# Altium schematic sheet etna-main-ui.SchDoc
size A4; DocumentNumber: 1; SheetNumber: 4; SheetTotal: 5; PageSetup: Record=PageOptions|CenterHorizontal=True|CenterVertical=True|PrintScale=0.73|XCorrection=1.00|YCorrection=1.00|PrintKind=1|BorderSize=5000000|LeftOffset=0|BottomOffset=0|Orientation=2|PaperLength=1000|PaperWidth=1000|Scale=100|PaperSource=15|PrintQuality=1200|MediaType=1|DitherType=10|PaperKind=A4|PrintScaleMode=1
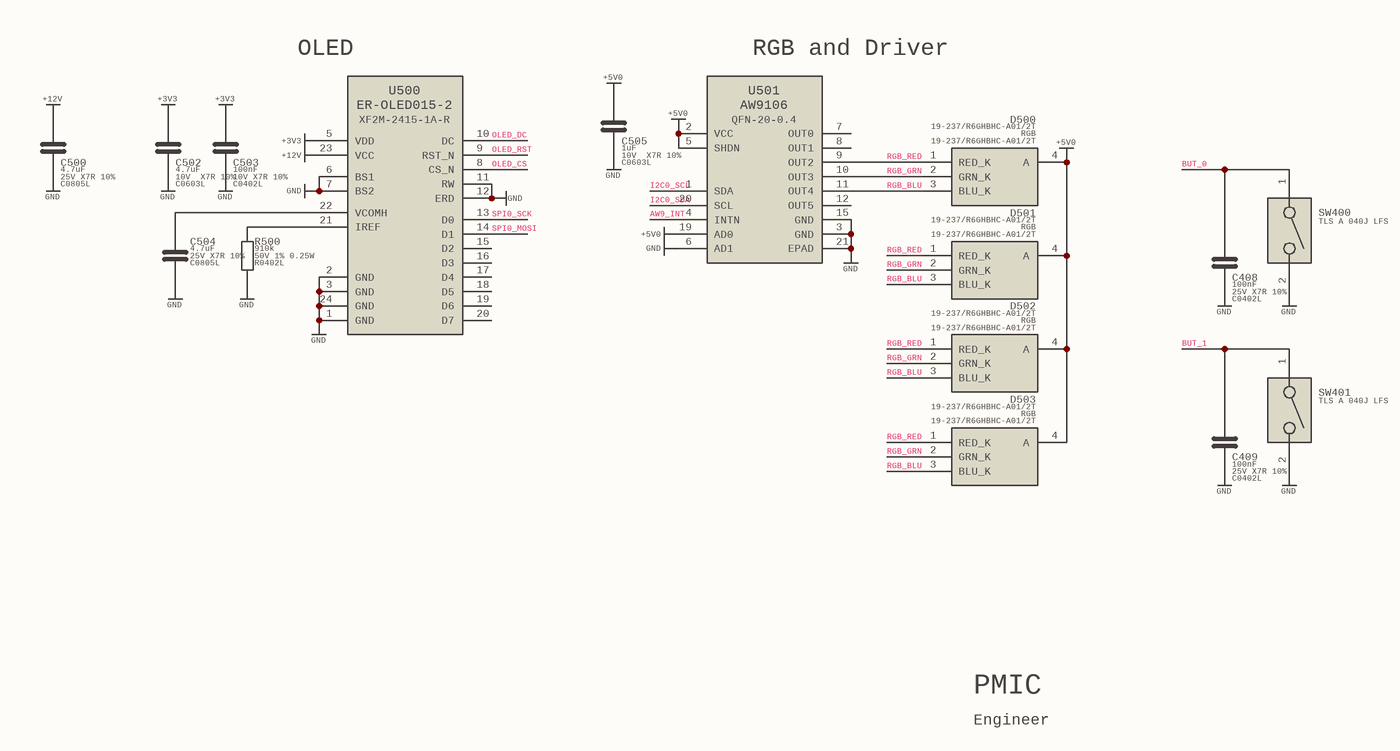
[diagram p0: etna-main-ui.SchDoc]

## Parts
C408  value 100nF  Specification: 25V X7R 10%  [C0402L]
C409  value 100nF  Specification: 25V X7R 10%  [C0402L]
C500  value 4.7uF  Specification: 25V X7R 10%  [C0805L]
C502  value 4.7uF  Specification: 10V  X7R 10%  [C0603L]
C503  value 100nF  Specification: 10V X7R 10%  [C0402L]
C504  value 4.7uF  Specification: 25V X7R 10%  [C0805L]
C505  value 1uF  Specification: 10V  X7R 10%  [C0603L]
D500  Specification: RGB  [19-237/R6GHBHC-A01/2T]  (hidden comment: 19-237/R6GHBHC-A01/2T)
D501  Specification: RGB  [19-237/R6GHBHC-A01/2T]  (hidden comment: 19-237/R6GHBHC-A01/2T)
D502  Specification: RGB  [19-237/R6GHBHC-A01/2T]  (hidden comment: 19-237/R6GHBHC-A01/2T)
D503  Specification: RGB  [19-237/R6GHBHC-A01/2T]  (hidden comment: 19-237/R6GHBHC-A01/2T)
R500  value 910k  Specification: 50V 1% 0.25W  [R0402L]
SW400  TLS A 040J LFS  [TLS A 040J LFS]
SW401  TLS A 040J LFS  [TLS A 040J LFS]
U500  ER-OLED015-2  [XF2M-2415-1A-R]
U501  value AW9106  [QFN-20-0.4]  (hidden comment: AW9109)

## Nets
+3V3: C502.1 C503.1 U500.5(VDD)
+5V0: C505.1 D500.4(A) D501.4(A) D502.4(A) D503.4(A) U501.2(VCC) U501.5(SHDN) U501.19(AD0)
+12V: C500.1 U500.23(VCC)
GND: C408.2 C409.2 C500.2 C502.2 C503.2 C504.2 C505.2 R500.2 SW400.2 SW401.2 U500.1(GND) U500.2(GND) U500.3(GND) U500.6(BS1) U500.7(BS2) U500.11(RW) U500.12(ERD) U500.24(GND) U501.3(GND) U501.6(AD1) U501.15(GND) U501.21(EPAD)
AW9_INT: U501.4(INTN)
BUT_0: C408.1 SW400.1
BUT_1: C409.1 SW401.1
I2C0_SCL: U501.1(SDA)
I2C0_SDA: U501.20(SCL)
OLED_CS: U500.8(CS_N)
OLED_DC: U500.10(DC)
OLED_RST: U500.9(RST_N)
RGB_BLU: D500.3(BLU_K) D501.3(BLU_K) D502.3(BLU_K) D503.3(BLU_K) U501.11(OUT4)
RGB_GRN: D500.2(GRN_K) D501.2(GRN_K) D502.2(GRN_K) D503.2(GRN_K) U501.10(OUT3)
RGB_RED: D500.1(RED_K) D501.1(RED_K) D502.1(RED_K) D503.1(RED_K) U501.9(OUT2)
SPI0_MOSI: U500.14(D1)
SPI0_SCK: U500.13(D0)
NetC504_1: C504.1 U500.22(VCOMH)
NetR500_1: R500.1 U500.21(IREF)

Not connected (* = marked no-connect by the designer): U500 15(D2) 16(D3) 17(D4) 18(D5) 19(D6) 20(D7) 44(N.C.); U501 7(OUT0) 8(OUT1) 12(OUT5) 44(N.C.)

## Notes on the sheet
- OLED
- RGB and Driver
- PMIC
- Engineer

## Library data of the parts
C408 C409 C500 C502-C505 = CAPACITOR_NONPOL
R500 = RESISTOR
SW400 SW401 = SWITCH
U501 = AW9106
D500-D503 = 19-237/R6GHBHC-A01/2T: Value: 19-237/R6GHBHC-A01/2T
U500 = ER-OLED015-2: Value: ER-OLED015-2